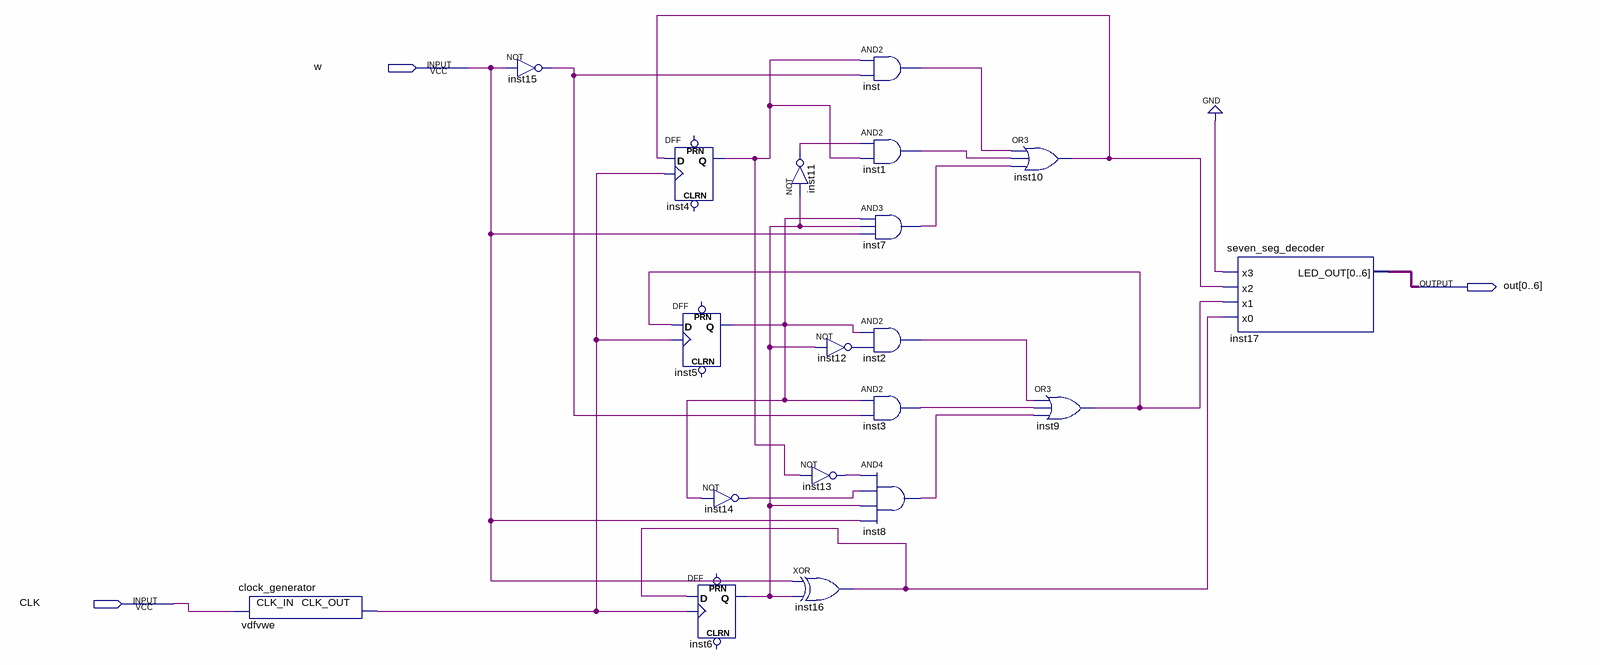
[diagram p0: schematic sheet]
// Quartus schematic lab11step1.bdf as structural Verilog: 19 symbols, 3 pins
module lab11step1 (
  input  w,
  input  CLK,
  output [0:6] out
);

  wire inst1_out, inst2_out, inst3_out, inst4_q, inst5_q, inst6_q, inst7_out, inst8_out, inst9_out,
       inst10_out, inst11_out, inst12_out, inst13_out, inst14_out, inst15_out, inst16_out, inst_out,
       vdfvwe_clk_out;

  clock_generator vdfvwe (.CLK_IN(CLK), .CLK_OUT(vdfvwe_clk_out));
  not inst15 (inst15_out, w);
  DFF inst4 (.CLK(vdfvwe_clk_out), .D(inst10_out), .Q(inst4_q));  // open: CLRN, PRN
  DFF inst5 (.CLK(vdfvwe_clk_out), .D(inst9_out), .Q(inst5_q));  // open: CLRN, PRN
  not inst14 (inst14_out, inst5_q);
  DFF inst6 (.CLK(vdfvwe_clk_out), .D(inst16_out), .Q(inst6_q));  // open: CLRN, PRN
  not inst11 (inst11_out, inst6_q);
  not inst12 (inst12_out, inst6_q);
  not inst13 (inst13_out, inst4_q);
  xor inst16 (inst16_out, w, inst6_q);
  and inst (inst_out, inst4_q, inst15_out);
  and inst1 (inst1_out, inst11_out, inst4_q);
  and inst7 (inst7_out, inst5_q, inst6_q, w);
  and inst2 (inst2_out, inst5_q, inst12_out);
  and inst3 (inst3_out, inst5_q, inst15_out);
  and inst8 (inst8_out, inst13_out, inst14_out, inst6_q, w);
  or inst10 (inst10_out, inst_out, inst1_out, inst7_out);
  or inst9 (inst9_out, inst2_out, inst3_out, inst8_out);
  seven_seg_decoder inst17 (.x3(1'b0), .x2(inst10_out), .x1(inst9_out), .x0(inst16_out), .LED_OUT(out));
endmodule
